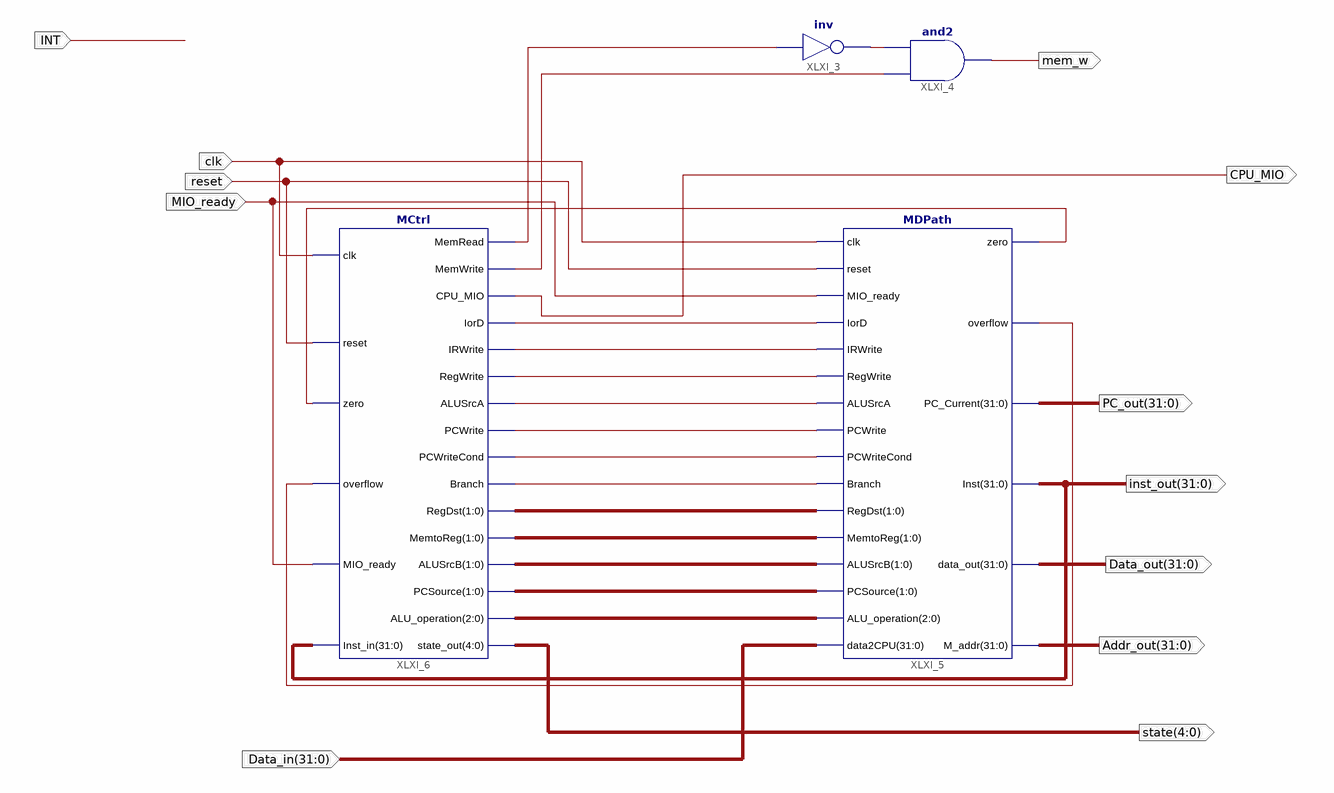
[diagram p0: schematic sheet 1]
// Xilinx ISE schematic MCPU.sch (kintex7) as structural Verilog: 4 symbols, 12 ports
module MCPU (
  input  clk,
  input  reset,
  input  MIO_ready,
  input  [31:0] Data_in,
  input  INT,
  output [31:0] inst_out,
  output [31:0] PC_out,
  output [31:0] Data_out,
  output [31:0] Addr_out,
  output CPU_MIO,
  output mem_w,
  output [4:0] state
);

  wire XLXN_10, XLXN_11, XLXN_12, XLXN_13, XLXN_14, XLXN_15, XLXN_16, XLXN_17, XLXN_18, XLXN_31, XLXN_32,
       XLXN_33;
  wire [1:0] XLXN_39, XLXN_41, XLXN_42, XLXN_43;
  wire [2:0] XLXN_40;

  not XLXI_3 (XLXN_33, XLXN_31);
  and XLXI_4 (mem_w, XLXN_32, XLXN_33);
  MDPath XLXI_5 (
    .clk(clk), .reset(reset), .MIO_ready(MIO_ready), .IorD(XLXN_12), .IRWrite(XLXN_13), .RegWrite(XLXN_14),
    .ALUSrcA(XLXN_15), .PCWrite(XLXN_16), .PCWriteCond(XLXN_17), .Branch(XLXN_18), .RegDst(XLXN_39),
    .MemtoReg(XLXN_43), .ALUSrcB(XLXN_42), .PCSource(XLXN_41), .ALU_operation(XLXN_40), .data2CPU(Data_in),
    .zero(XLXN_11), .overflow(XLXN_10), .PC_Current(PC_out), .Inst(inst_out), .data_out(Data_out),
    .M_addr(Addr_out));
  MCtrl XLXI_6 (
    .zero(XLXN_11), .overflow(XLXN_10), .MIO_ready(MIO_ready), .Inst_in(inst_out), .MemRead(XLXN_31),
    .MemWrite(XLXN_32), .CPU_MIO(CPU_MIO), .IorD(XLXN_12), .IRWrite(XLXN_13), .RegWrite(XLXN_14),
    .ALUSrcA(XLXN_15), .PCWrite(XLXN_16), .PCWriteCond(XLXN_17), .Branch(XLXN_18), .RegDst(XLXN_39),
    .MemtoReg(XLXN_43), .ALUSrcB(XLXN_42), .PCSource(XLXN_41), .ALU_operation(XLXN_40), .state_out(state),
    .reset(reset), .clk(clk));
endmodule
